# Altium project Analog Discovery Addon.PrjPcb
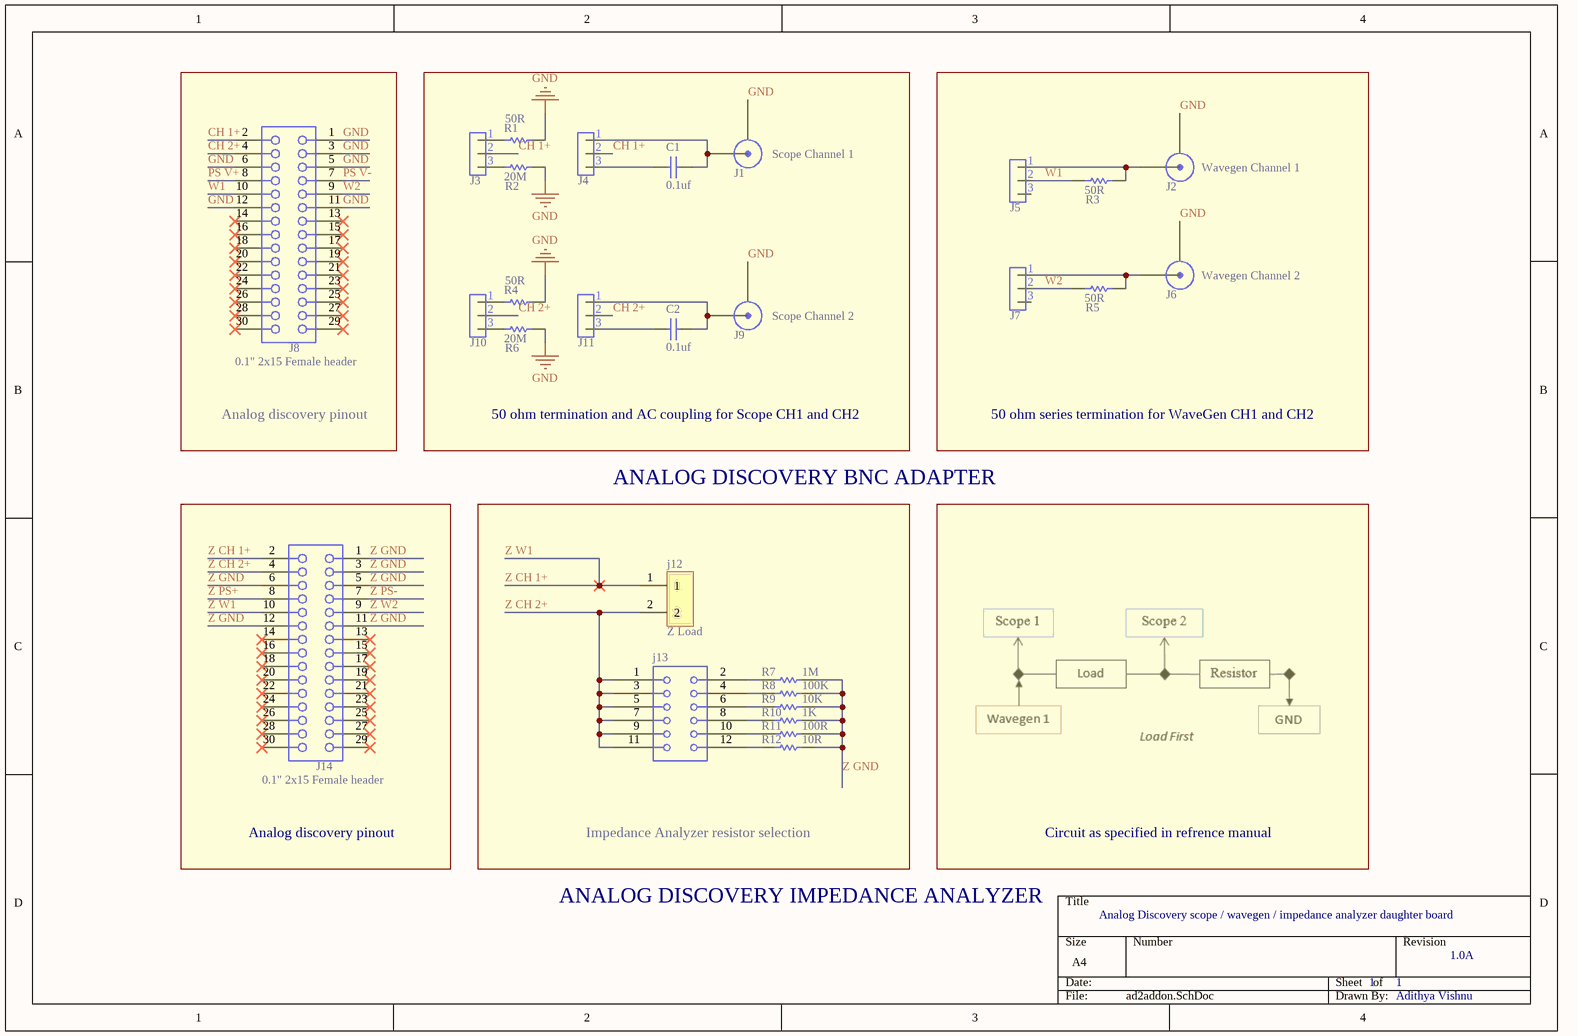
[diagram p0: ad2addon.SchDoc]
1 sheet, 28 parts. Net scope: global (net labels, ports and power ports of the same name join across sheets).

## Sheet ad2addon.SchDoc
size A4

### Parts
C1  0.1uf  [CAPC2013X94X50NL20T25]
C2  0.1uf  [CAPC2013X94X50NL20T25]
J1  Part placement: Scope Channel 1  [PCB-bp7jxlavj6ad2jzc7otg-1]  (hidden comment: Amphenol 031-5431-2010)
J2  Part placement: Wavegen Channel 1  [PCB-bp7jxlavj6ad2jzc7otg-1]  (hidden comment: Amphenol 031-5431-2010)
J3  SYM-52d299a8d8748d15-1  [PCB-vkgeqjtjqx6hhmcxuagx-1]  (value not drawn)
J4  SYM-52d299a8d8748d15-1  [PCB-vkgeqjtjqx6hhmcxuagx-1]  (value not drawn)
J5  SYM-52d299a8d8748d15-1  [PCB-vkgeqjtjqx6hhmcxuagx-1]  (value not drawn)
J6  Part placement: Wavegen Channel 2  [PCB-bp7jxlavj6ad2jzc7otg-1]  (hidden comment: Amphenol 031-5431-2010)
J7  SYM-52d299a8d8748d15-1  [PCB-vkgeqjtjqx6hhmcxuagx-1]  (value not drawn)
J8  0.1" 2x15 Female header  [SMTC-ESQ-115-13-X-D]
J9  Part placement: Scope Channel 2  [PCB-bp7jxlavj6ad2jzc7otg-1]  (hidden comment: Amphenol 031-5431-2010)
J10  SYM-52d299a8d8748d15-1  [PCB-vkgeqjtjqx6hhmcxuagx-1]  (value not drawn)
J11  SYM-52d299a8d8748d15-1  [PCB-vkgeqjtjqx6hhmcxuagx-1]  (value not drawn)
j12  SYM-ced9058a17fd111e-1  [PCB-7j6xxwhkpc3kmbxd3myr-1]  (value not drawn)
j13  TE Connectivity / AMP 826656-6  [PCB-lq5xkcy8zqh038dq8ik0-1]  (value not drawn)
J14  0.1" 2x15 Female header  [SMTC-ESQ-115-13-X-D]
R1  50R  [RESC2013X60X35LL10T20]
R2  20M  [RESC2013X60X35LL10T20]
R3  50R  [RESC2013X60X35LL10T20]
R4  50R  [RESC2013X60X35LL10T20]
R5  50R  [RESC2013X60X35LL10T20]
R6  20M  [RESC2013X60X35LL10T20]
R7  1M  [RESC2013X60X35LL10T20]
R8  100K  [RESC2013X60X35LL10T20]
R9  10K  [RESC2013X60X35LL10T20]
R10  1K  [RESC2013X60X35LL10T20]
R11  100R  [RESC2013X60X35LL10T20]
R12  10R  [RESC2013X60X35LL10T20]

### Blocks framed on the sheet
Analog discovery pinout: J8
50 ohm termination and AC coupling for Scope CH1 and CH2: C1 C2 J1 J3 J4 J9-J11 R1 R2 R4 R6
50 ohm series termination for WaveGen CH1 and CH2: J2 J5-J7 R3 R5
Analog discovery pinout: J14
ANALOG DISCOVERY BNC ADAPTER: j12 j13 R7-R12

### Nets
GND: J1.2 J2.2 J6.2 J8.1 J8.3 J8.5 J8.6 J8.11 J8.12 J9.2 R1.1 R2.1 R4.1 R6.1
CH 1+: J3.2 J4.2 J8.2
CH 2+: J8.4 J10.2 J11.2
PS V+: J8.8
PS V-: J8.7
W1: J5.2 J8.10 R3.2
W2: J7.2 J8.9 R5.2
Z CH 1+: j12.1 J14.2 J14.10  [also labelled Z W1]
Z CH 2+: j12.2 j13.1 j13.3 j13.5 j13.7 j13.9 j13.11 J14.4
Z GND: J14.1 J14.3 J14.5 J14.6 J14.11 J14.12 R7.1 R8.1 R9.1 R10.1 R11.1 R12.1
Z PS+: J14.8
Z PS-: J14.7
Z W2: J14.9
NetC1_1: C1.1 J4.3
NetC1_2: C1.2 J1.1 J4.1
NetC2_1: C2.1 J11.3
NetC2_2: C2.2 J9.1 J11.1
NetJ2_1: J2.1 J5.1 R3.1
NetJ3_1: J3.1 R1.2
NetJ3_3: J3.3 R2.2
NetJ6_1: J6.1 J7.1 R5.1
NetJ10_1: J10.1 R4.2
NetJ10_3: J10.3 R6.2
Netj13_2: j13.2 R7.2
Netj13_4: j13.4 R8.2
Netj13_6: j13.6 R9.2
Netj13_8: j13.8 R10.2
Netj13_10: j13.10 R11.2
Netj13_12: j13.12 R12.2

Not connected (* = marked no-connect by the designer): J5 3; J7 3; J8 13* 14* 15* 16* 17* 18* 19* 20* 21* 22* 23* 24* 25* 26* 27* 28* 29* 30*; J14 13* 14* 15* 16* 17* 18* 19* 20* 21* 22* 23* 24* 25* 26* 27* 28* 29* 30*

### Notes on the sheet
- (near j12) Z Load
- Impedance Analyzer resistor selection
- Circuit as specified in refrence manual
- ANALOG DISCOVERY IMPEDANCE ANALYZER
- Analog Discovery scope / wavegen / impedance analyzer daughter board
- 1
- 1.0A
- Adithya Vishnu

### Library data of the parts
C1 C2 = CMP-126791-4: CAP
J1 J2 J6 J9 = CMP-8fb544cbd9675072-1: Right Angle 50Ohm Thru Hole Bulkhead Fitting BNC Conn, jack, Solder Term Nickel; Octopart URL: https://octopart.com/5-1634556-0-te+connectivity-41186228; Contact Material: Phosphor Bronze
J3-J5 J7 J10 J11 = CMP-740dbf71fd8babca-16: AMPMODU 3 Position 2.54 mm Single Row Through-Hole Straight Breakaway Header; Number of Contacts: 3; Octopart URL: http://octopart.com/5-146274-3-te+connectivity+%2F+amp-41331936; Contact Material: Phosphor Bronze
J8 J14 = CMP-4026240-2: PC/104(TM) Elevated Socket Strip, Through-hole, Vertical, -55 to 125 degC, 2.54 mm Pitch, 30-Pin, Female, RoHS; Manufacturer Part Number: ESQ-115-13-G-D; Number of Contacts: 30; Contact Material: Phosphor Bronze; Contact Plating: Gold; Gender: Female; Mounting Style: Solder; Octopart Url: https://octopart.com/esq-115-13-g-d-samtec-11579058; OctopartID: 6acca376e118b50b; REACH SVHC Compliance: No SVHC; RoHS: Compliant
j12 = CMP-50ff9bac89d88f38-17: Connector Terminal Blocks Receptacle 2 Position 5.08mm Solder Straight Thru-Hole 13.5A/Contact; Number of Positions: 2; Voltage Rating (AC): 250 V; Lead-Free Status: Lead Free; Packaging: Bulk; Color: Green; Contact Material: Brass; Number of Contacts: 2; OctopartID: ced9058a17fd111e; Contact Plating: Tin; Mounting Style: PC Board, PCB; Housing Material: Nylon 6/6; Lifecycle Status: Active
j13 = CMP-a42c6f58fc837beb-1: Conn Unshrouded Header HDR 12 POS 2.54mm Solder ST Thru-Hole Carton; ELV Compliant: Compliant; Lifecycle Status: Active; RoHS: Compliant; Octopart URL: http://octopart.com/826656-6-te+connectivity+%2F+amp-41844169; Housing Material: Thermoplastic; Flammability Rating: UL 94 V-0; Contact Material: Phosphor Bronze; Mounting Style: PCB; Housing Color: Green; OctopartID: a42c6f58fc837beb; Orientation: Vertical; Contact Plating: Tin, Gold, Gold over Nickel; Manufacturer Part Number: 826656-6
R1 R3-R5 = CMP-4762415-2: Res Thick Film 0805; Resistance Tolerance: ±5%; Case/Package: 0805; Mounting Style: Surface Mount; RoHS: Compliant
R2 R6-R12 = CMP-4762415-2: Res Thick Film 0805 20M Ohm 5% 1/8W 200ppm/C Molded SMD SMD Paper T/R; Manufacturer Part Number: RC0805JR-0720ML; Lead-Free Status: Lead Free; Case/Package: 0805; Mounting Style: Surface Mount; Octopart Url: https://octopart.com/rc0805jr-0720ml-yageo-9295906; OctopartID: d8c7114025830700; Resistance Tolerance: ±5%; RoHS: Compliant